# Altium schematic sheet DONGLE01.SchDoc: DONGLE01
size A4; Organization: Organization; Address1: Country; Address2: My Address; Address3: My State; Address4: MyZipCode; DocumentNumber: 1; Revision: 1.4; SheetNumber: 1; SheetTotal: 1
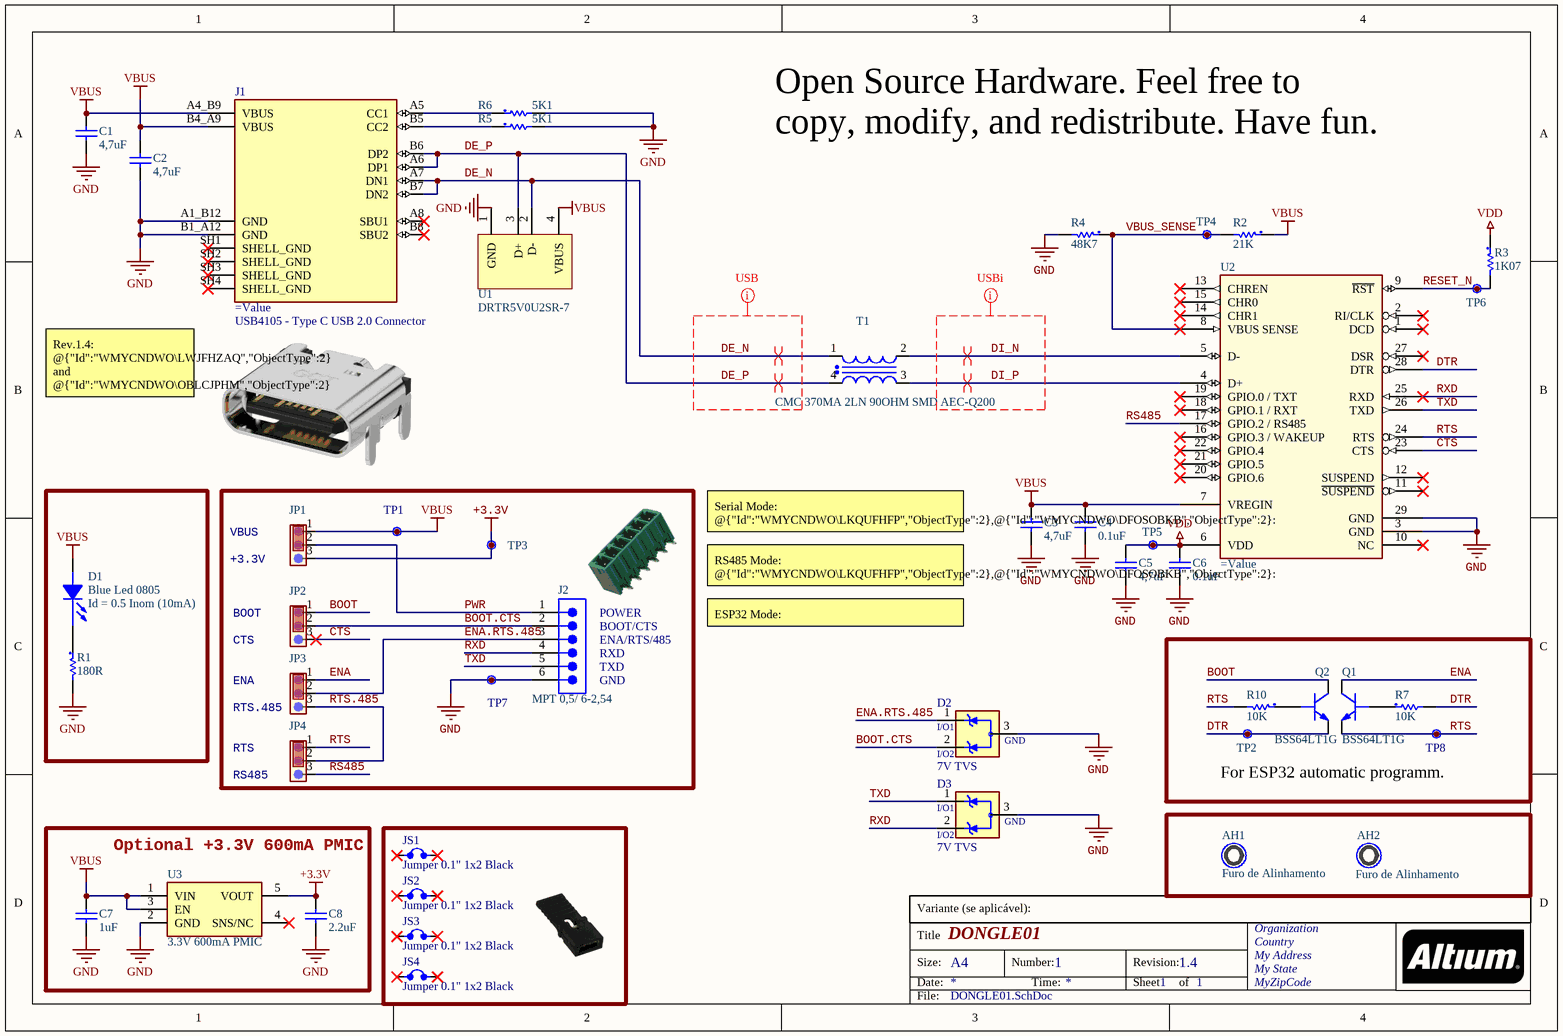
[diagram p0: DONGLE01.SchDoc]

## Parts
AH1  Furo de Alinhamento  [AH_2.0MMD]  (no BOM)
AH2  Furo de Alinhamento  [AH_2.0MMD]  (no BOM)
C1  4,7uF  [C0805]
C2  4,7uF  [C0805]
C3  4,7uF  [C0805]
C4  0.1uF  [C0805]
C5  4,7uF  [C0805]
C6  0.1uF  [C0805]
C7  1uF  [C0805]
C8  2.2uF  [C0805]
D1  Blue Led 0805  Info: Id = 0.5 Inom (10mA)  [LED 0805]
D2  7V TVS  [WE-TVS_SOT23-3L]
D3  7V TVS  [WE-TVS_SOT23-3L]
J1  Info: USB4105 - Type C USB 2.0 Connector  [GCT_USB4105-GF-A-060]
J2  MPT 0,5/ 6-2,54  [1725698]
JP1  Header 3 Pin  [JMP-3-PTH-180]  (value not drawn)  (no BOM)
JP2  Header 3 Pin  [JMP-3-PTH-180]  (value not drawn)  (no BOM)
JP3  Header 3 Pin  [JMP-3-PTH-180]  (value not drawn)  (no BOM)
JP4  Header 3 Pin  [JMP-3-PTH-180]  (value not drawn)  (no BOM)
JS1  Jumper 0.1" 1x2 Black  [BERG-M-2V]  (mechanical)
JS2  Jumper 0.1" 1x2 Black  [BERG-M-2V]  (mechanical)
JS3  Jumper 0.1" 1x2 Black  [BERG-M-2V]  (mechanical)
JS4  Jumper 0.1" 1x2 Black  [BERG-M-2V]  (mechanical)
Q1  BSS64LT1G  [SOT-23]
Q2  BSS64LT1G  [SOT-23]
R1  180R  [R0805]
R2  21K  [R0805]
R3  1K07  [R0805]
R4  48K7  [R0805]
R5  5K1  [R0805]
R6  5K1  [R0805]
R7  10K  [R0805]
R10  10K  [R0805]
T1  CMC 370MA 2LN 90OHM SMD AEC-Q200  [744232090]
TP1  (no value)  [TP]  (no BOM)
TP2  (no value)  [TP]  (no BOM)
TP3  (no value)  [TP]  (no BOM)
TP4  (no value)  [TP]  (no BOM)
TP5  (no value)  [TP]  (no BOM)
TP6  (no value)  [TP]  (no BOM)
TP7  (no value)  [TP]  (no BOM)
TP8  (no value)  [TP]  (no BOM)
U1  Manufacturer P/N: DRTR5V0U2SR-7  [SOT143-4]  (hidden comment: USB ESD protection)
U2  (no value)  [QFN50P500X500X80_HS-29N CP2102N]
U3  3.3V 600mA PMIC  [SOT94P280X100-5N]

## Blocks framed on the sheet
Optional +3.3V 600mA PMIC: C7 C8 U3

## Nets
+3.3V: C8.1 JP1.3 TP3.1(A) U3.5(VOUT)
GND: C1.2 C2.2 C3.2 C4.2 C5.2 C6.2 C7.2 C8.2 D2.3(GND) D3.3(GND) J1.A1_B12(GND) J1.B1_A12(GND) J2.6 R1.2 R4.2 R5.2 R6.2 TP7.1(A) U1.1(GND) U2.3(GND) U2.29(GND) U3.2(GND)
VBUS: C1.1 C2.1 C3.1 C4.1 C7.1 D1.A J1.A4_B9(VBUS) J1.B4_A9(VBUS) JP1.1 R2.1 TP1.1(A) U1.4(VBUS) U2.7(VREGIN) U3.1(VIN) U3.3(EN)
VDD: C5.1 C6.1 R3.1 TP5.1(A) U2.6(VDD)
BOOT: JP2.1 Q2.3(C)
BOOT.CTS: D2.2(I/O2) J2.2 JP2.2
CTS: JP2.3 U2.23(CTS)
DE_N: J1.A7(DN1) J1.B7(DN2) T1.1 U1.2(D-)
DE_P: J1.A6(DP1) J1.B6(DP2) T1.4 U1.3(D+)
DI_N: T1.2 U2.5(D-)
DI_P: T1.3 U2.4(D+)
DTR: Q2.2(E) R7.2 TP2.1(A) U2.28(DTR)
ENA: JP3.1 Q1.3(C)
ENA.RTS.485: D2.1(I/O1) J2.3 JP3.2
PWR: J2.1 JP1.2
RESET_N: R3.2 TP6.1(A) U2.9(~{RST})
RS485: JP4.3 U2.17(GPIO.2_/_RS485)
RTS: JP4.1 Q1.2(E) R10.2 TP8.1(A) U2.24(RTS)
RTS.485: JP3.3 JP4.2
RXD: D3.2(I/O2) J2.4 U2.25(RXD)
TXD: D3.1(I/O1) J2.5 U2.26(TXD)
VBUS_SENSE: R2.2 R4.1 TP4.1(A) U2.8(VBUS_SENSE)
NetD1_K: D1.K R1.1
NetJ1_A5: J1.A5(CC1) R6.1
NetJ1_B5: J1.B5(CC2) R5.1
NetQ1_1: Q1.1(B) R7.1
NetQ2_1: Q2.1(B) R10.1

Not connected (* = marked no-connect by the designer): J1 A8(SBU1)* B8(SBU2)* SH1(SHELL_GND)* SH2(SHELL_GND)* SH3(SHELL_GND)* SH4(SHELL_GND)*; JS1 1* 2*; JS2 1* 2*; JS3 1* 2*; JS4 1* 2*; U2 1(DCD)* 2(RI/CLK)* 10(NC)* 11(~{SUSPEND})* 12(SUSPEND)* 13(CHREN)* 14(CHR1)* 15(CHR0)* 16(GPIO.3_/_WAKEUP)* 18(GPIO.1_/_RXT)* 19(GPIO.0_/_TXT)* 20(GPIO.6)* 21(GPIO.5)* 22(GPIO.4)* 27(DSR)*; U3 4(SNS/NC)*

## Layout directives
differential pair: DE_N, DE_P, DI_N, DI_P
net class USB; rule Differential Pairs Routing [Pref Gap = 4.506mil    Min Gap  = 4.506mil    Max Gap  = 4.506milPref Width = 9mil    Min Width  = 9mil    Max Width  = 9mil]: DE_N, DE_P
net class USBi; rule Differential Pairs Routing [Pref Gap = 4.506mil    Min Gap  = 4.506mil    Max Gap  = 4.506milPref Width = 9mil    Min Width  = 9mil    Max Width  = 9mil]: DI_N, DI_P

## Notes on the sheet
- Open Source Hardware. Feel free to copy, modify, and redistribute. Have fun.
- Rev.1.4: @{"Id":"WMYCNDWO\LWJFHZAQ","ObjectType":2} and @{"Id":"WMYCNDWO\OBLCJPHM","ObjectType":2} corrected to 4,7uF. Added new @{"Id":"WMYCNDWO\WQULBWGF","ObjectType":2}.
- (near JP1) VBUS
- +3.3V
- Serial Mode: @{"Id":"WMYCNDWO\LKQUFHFP","ObjectType":2},@{"Id":"WMYCNDWO\DFOSOBKB","ObjectType":2}: 2-3, @{"Id":"WMYCNDWO\IGVTLTZP","ObjectType":2}: 1-2. Use DONGLE02 module for RS232 levels..
- RS485 Mode: @{"Id":"WMYCNDWO\LKQUFHFP","ObjectType":2},@{"Id":"WMYCNDWO\DFOSOBKB","ObjectType":2}: 2-3, @{"Id":"WMYCNDWO\IGVTLTZP","ObjectType":2}: 2-3. There is no RS485 module (yet).
- BOOT
- CTS
- (near J2) POWER
- (near J2) BOOT/CTS
- (near J2) RXD
- (near J2) ENA/RTS/485
- ESP32 Mode: @{"Id":"WMYCNDWO\LKQUFHFP","ObjectType":2},@{"Id":"WMYCNDWO\DFOSOBKB","ObjectType":2}: 1-2, @{"Id":"WMYCNDWO\IGVTLTZP","ObjectType":2}: don't care
- ENA
- RTS.485
- (near J2) TXD
- (near J2) GND
- RTS
- (near JP4) RS485
- For ESP32 automatic programm.
- Variante (se aplicável):
- Title
- Size:
- Date:
- A4
- Number:
- Time:
- Revision:
- Sheet
- of
- File:

## Library data of the parts
AH1 AH2 = Aligment Hole M2: RefDes: RefDes
C1-C3 C5 = CAP: 4.7 µF ±5% 25V Capacitor de cerâmica X7R 0805 (métrico 2012); Manufacturer: KEMET; Manufacturer P/N: C0805C475J3RACTU; Info: 25V 5% X7R; Supplier: Digikey; Supplier P/N (TR): 399-C0805C475J3RACTUTR-ND; Value: 4,7uF; Supplier P/N (CT): 399-C0805C475J3RACTUCT-ND; Datasheet: https://www.yageogroup.com/content/datasheet/asset/file/KEM_C1002_X7R_SMD; RefDes: RefDes; Supplier Web Page: https://www.digikey.com.br/pt/products/detail/kemet/C0805C475J3RACTU/12700961
C4 C6 = CAP: 0.1 µF ±10% 100V Ceramic Capacitor X7R 0805 (2012 Metric); Manufacturer: Murata Electronics; Manufacturer P/N: GCM21BR72A104KA37L; Info: MLCC; Supplier: Digikey; Supplier P/N (Tape & Reel): 490-4789-2-ND; Value: 0.1uF; Supplier P/N (Cut Tape): 490-4789-1-ND; Datasheet: https://search.murata.co.jp/Ceramy/image/img/A01X/G101/ENG/GCM033R71A103KA03-01A.pdf; RefDes: RefDes; Supplier Web Page: https://www.digikey.com/en/products/detail/murata-electronics/GCM21BR72A104KA37L/1641663?s=N4IgTCBcDaICwE4AMBaOB2AHAlA2FAcgCIgC6AvkA
C7 = CAP: 1 µF ±5% 16V Ceramic Capacitor X7R 0805 (2012 Metric); Manufacturer: KEMET; Manufacturer P/N: C0805C105J4RAC7800; Info: MLCC; Supplier: Digikey; Supplier P/N (Tape & Reel): 399-C0805C105J4RAC7800TR-ND; Value: 1uF; Supplier P/N (Cut Tape): 399-C0805C105J4RAC7800CT-ND; Datasheet: https://connect.kemet.com:7667/gateway/IntelliData-ComponentDocumentation/1.0/download/datasheet/C0805C105J4RACTU; RefDes: RefDes; Supplier Web Page: https://www.digikey.com/en/products/detail/kemet/C0805C105J4RAC7800/2211759?s=N4IgTCBcDaIMIAYAcCCscCMaBSAWASgIJwDsKCIAugL5A
C8 = CAP: 2.2 µF ±5% 16V Ceramic Capacitor X7R 0805 (2012 Metric); Manufacturer: KEMET; Manufacturer P/N: C0805C225J4REC7800; Info: MLCC; Supplier: Digikey; Supplier P/N (Tape & Reel): 399-C0805C225J4REC7800TR-ND; Value: 2.2uF; Supplier P/N (Cut Tape): 399-C0805C225J4REC7800CT-ND; Datasheet: https://content.kemet.com/datasheets/KEM_C1090_X7R_ESD.pdf; RefDes: RefDes; Supplier Web Page: https://www.digikey.com/en/products/detail/kemet/C0805C225J4REC7800/8643702?s=N4IgTCBcDaIMIAYAcCCscxlQKQCwCUBROAdhQRAF0BfIA
D1 = LED GREEN 0805: Blue 470nm LED Indication - Discrete 3.2V 0805 (2012 Metric); Manufacturer: Würth Elektronik; Manufacturer P/N: 150080BS75000; RefDes: RefDes; Value: Blue Led 0805; Supplier Web Page: https://www.digikey.com/en/products/detail/w%C3%BCrth-elektronik/150080BS75000/4489912; Supplier P/N (Tape & Reel): 732-4982-2-ND; Supplier P/N (Cut Tape): 732-4982-1-ND; Supplier: Digikey; Datasheet: https://www.we-online.com/components/products/datasheet/150080BS75000.pdf
D2 D3 = WE-TVS_SOT23-3L_824021: 7V Clamp 15A (8/20µs) Ipp Tvs Diode Surface Mount SOT-23-3; Manufacturer: Würth Elektronik; Manufacturer P/N: 824021; Value: 7V TVS; RefDes: RefDes; Supplier: Digikey; Supplier P/N (Cut Tape): 732-4468-1-ND; Supplier P/N (Tape & Reel): 732-4468-2-ND; Supplier Web Page: https://www.digikey.com/en/products/detail/w%C3%BCrth-elektronik/824021/3900544; Datasheet: https://www.we-online.com/components/products/datasheet/824021.pdf; Info: TVS Diode
J1 = USB4105-GF-A-060: USB-C (USB TYPE-C) USB 2.0 Receptacle Connector 24 (16+8 Dummy) Position Surface Mount, Right Angle; Through Hole; Manufacturer: Global Connector Technology; Value: USB4105-GF-A-060; Supplier P/N (CT): 2073-USB4105-GF-ACT-ND; Supplier P/N (TR): 2073-USB4105-GF-ATR-ND; Supplier P/N (DR): 2073-USB4105-GF-ADKR-ND; Supplier Web: https://www.digikey.com.br/pt/products/detail/gct/USB4105-GF-A/11198441; Datasheet: https://www.mouser.com/catalog/specsheets/Global_Connector_Technology_usb4105.pdf; Alias1: *; Manufacturer P/N: USB4105-GF-A-060; RefDes: *; Supplier: Digikey
J2 = 691322110006: 6 Position Wire to Board Terminal Block Horizontal with Board 0.100" (2.54mm) Through Hole; Manufacturer: Phoenix Contact; Info: Borne 6pos 6A e=2,54; Manufacturer P/N: 1725698; Supplier: Digikey; Supplier P/N (Tape & Reel): 277-1277-ND; Value: MPT 0,5/ 6-2,54; Datasheet: https://www.phoenixcontact.com/en-us/products/printed-circuit-board-terminal-mpt-05-6-254-1725698?type=pdf; Supplier P/N (Cut Tape): 277-1277-ND; RefDes: RefDes; Supplier Web Page: https://www.digikey.com/en/products/detail/phoenix-contact/1725698/267466
JP1-JP4 = Jumper 3: 3 Pin Jumper; Manufacturer P/N: 61300311121; Manufacturer: Würth Elektronik; Info: 0.1" Pin header 1x3; RefDes: RefDes; Value: Header 3 Pin; Supplier Web Page: https://www.digikey.com/en/products/detail/w%C3%BCrth-elektronik/61300311121/4846825; Supplier P/N (Tape & Reel): 732-5316-ND; Supplier P/N (Cut Tape): 732-5316-ND; Supplier: Digikey; Datasheet: https://www.we-online.com/components/products/datasheet/61300311121.pdf
JS1-JS4 = Jumper 2: 2 (1 x 2) Position Shunt Connector Open Top, Grip 0.100" (2.54mm) Gold; Manufacturer P/N: NPC02SXON-RC; Manufacturer: Sullins Connector Solutions; RefDes: RefDes; Info: Jumper 0.1" 1x2 Black; Value: Jumper 0.1" 1x2 Black; Supplier Web Page: https://www.digikey.com/en/products/detail/sullins-connector-solutions/NPC02SXON-RC/2618266; Supplier P/N (Tape & Reel): S9341-ND; Supplier P/N (Cut Tape): S9341-ND; Supplier: Digikey; Datasheet: https://s3.amazonaws.com/catalogspreads-pdf/PAGE128-129%20.100%20JUMPER.pdf
Q1 Q2 = TR-NPN-BC817-SOT23: Bipolar (BJT) Transistor NPN 80 V 100 mA 60MHz 225 mW Surface Mount SOT-23-3 (TO-236); Manufacturer: onsemi; Info: VCEsat max 200mV; Supplier: Digikey; Manufacturer P/N: BSS64LT1G; Value: BSS64LT1G; Supplier P/N (Tape & Reel): BSS64LT1GOSTR-ND; Supplier P/N (Cut Tape): BSS64LT1GOSCT-ND; Datasheet: https://www.onsemi.com/pdf/datasheet/bss64lt1-d.pdf; RefDes: RefDes; Supplier Web Page: https://www.digikey.com/en/products/detail/onsemi/BSS64LT1G/1476267?s=N4IgTCBcDaIEIGUEDYAsAZAKgRgOIgF0BfIA
R1 = RESISTOR: 180 Ohms ±1% 0.25W, 1/4W Chip Resistor 0805 (2012 Metric) Anti-Sulfur Thin Film; Manufacturer: Stackpole Electronics Inc; Manufacturer P/N: RNCP0805FTD180R; Info: 1% 100 PPM; RefDes: RefDes; Supplier: Digikey; Supplier P/N (Tape & Reel): RNCP0805FTD180RTR-ND; Value: 180R; Datasheet: https://www.seielect.com/catalog/sei-rncp.pdf; Supplier P/N (Cut Tape): RNCP0805FTD180RCT-ND; Supplier Web Page: https://www.digikey.com/en/products/detail/stackpole-electronics-inc/RNCP0805FTD180R/2240212
R2 = RESISTOR: 21 kOhms ±1% 0.125W, 1/8W Chip Resistor 0805 (2012 Metric) Moisture Resistant Thick Film; Manufacturer: YAGEO; Manufacturer P/N: RC0805FR-0721KL; Info: 1% 100 PPM; Value: 21K; Supplier P/N (Cut Tape): 311-21.0KCRCT-ND; Supplier: Digikey; Datasheet: https://www.yageo.com/upload/media/product/products/datasheet/rchip/PYu-RC_Group_51_RoHS_L_12.pdf; RefDes: RefDes; Supplier P/N (Tape & Reel): 311-21.0KCRTR-ND; Supplier Web Page: https://www.digikey.com/en/products/detail/yageo/RC0805FR-0721KL/727728
R3 = RESISTOR: 1.07 kOhms ±1% 0.125W, 1/8W Chip Resistor 0805 (2012 Metric) Automotive AEC-Q200 Thick Film; Manufacturer P/N: CRCW08051K07FKEA; Manufacturer: Vishay Dale; Info: 1% 100 PPM; Value: 1K07; Supplier: Digikey; Supplier P/N (Tape & Reel): 541-1.07KCTR-ND; Supplier P/N (Cut Tape): 541-1.07KCCT-ND; Datasheet: https://www.vishay.com/docs/20035/dcrcwe3.pdf; RefDes: RefDes; Supplier Web Page: https://www.digikey.com/en/products/detail/vishay-dale/CRCW08051K07FKEA/1175640
R4 = RESISTOR: 48.7 kOhms ±1% 0.125W, 1/8W Chip Resistor 0805 (2012 Metric) Moisture Resistant Thick Film; Manufacturer P/N: RC0805FR-0748K7L; Manufacturer: YAGEO; Info: 1% 100 PPM; Value: 48K7; Supplier: Digikey; Supplier P/N (Tape & Reel): 311-48.7KCRTR-ND; Supplier P/N (Cut Tape): 311-48.7KCRCT-ND; Datasheet: https://www.yageo.com/upload/media/product/products/datasheet/rchip/PYu-RC_Group_51_RoHS_L_12.pdf; RefDes: RefDes; Supplier Web Page: https://www.digikey.com/en/products/detail/yageo/RC0805FR-0748K7L/727981
R5 R6 = RESISTOR: 5.1 kOhms ±1% 0.125W, 1/8W Chip Resistor 0805 (2012 Metric) Moisture Resistant Thick Film; Manufacturer: YAGEO; Manufacturer P/N: RC0805FR-075K1L; Info: 1% 100 PPM; RefDes: RefDes; Supplier: Digikey; Supplier P/N (Tape & Reel): 311-5.10KCRTR-ND; Value: 5K1; Datasheet: https://www.yageo.com/upload/media/product/products/datasheet/rchip/PYu-RC_Group_51_RoHS_L_12.pdf; Supplier P/N (Cut Tape): 311-5.10KCRCT-ND; Supplier Web Page: https://www.digikey.com/en/products/detail/yageo/RC0805FR-075K1L/727988
R7 R10 = RESISTOR: 10 kOhms ±1% 0.125W, 1/8W Chip Resistor 0805 (2012 Metric) Automotive AEC-Q200 Thick Film; Manufacturer P/N: RMCF0805FT10K0; Manufacturer: Stackpole Electronics Inc; Info: 1% 100PPM; Value: 10K; Supplier: Digikey; Supplier P/N (Tape & Reel): RMCF0805FT10K0TR-ND; Supplier P/N (Cut Tape): RMCF0805FT10K0CT-ND; Datasheet: https://www.seielect.com/catalog/sei-rmcf_rmcp.pdf; RefDes: RefDes; Supplier Web Page: https://www.digikey.com/en/products/detail/stackpole-electronics-inc/RMCF0805FT10K0/1760676
T1 = USB EMI FILTER: 2 Line Common Mode Choke Surface Mount 90 Ohms @ 100 MHz 370mA DCR 300mOhm; Manufacturer: Würth Elektronik; Info: EMI Trafo; Value: CMC 370MA 2LN 90OHM SMD AEC-Q200; Manufacturer P/N: 744232090; Supplier: Digikey; Supplier P/N (Tape & Reel): 732-1469-2-ND; Supplier P/N (Cut Tape): 732-1469-1-ND; Datasheet: https://www.we-online.com/components/products/datasheet/744232090.pdf; RefDes: RefDes; Supplier Web Page: https://www.digikey.com/en/products/detail/w%C3%BCrth-elektronik/744232090/1638873?s=N4IgTCBcDaIOwGYwFoCMAWAbATmZ5AcgCIgC6AvkA
TP1-TP8 = TESTPOINT
  TP1 TP7 TP8: RefDes: rRefDes; Supplier: Digikey
  TP2-TP6: RefDes: RefDes
U1 = USB2.0_TVS_DIODES: Clamp Ipp Tvs Diode Surface Mount SOT-143; Manufacturer: Diodes Incorporated; Info: ESD Protection Device; Value: USB ESD protection; Supplier P/N (Cut Tape): DRTR5V0U2SR-7DICT-ND; Supplier Web Page: https://www.digikey.com/en/products/detail/diodes-incorporated/DRTR5V0U2SR-7/4402528; Supplier P/N (Tape & Reel): DRTR5V0U2SR-7DITR-ND; Supplier: Digikey; Datasheet: https://www.diodes.com/assets/Datasheets/DRTR5V0U2SR.pdf; RefDes: RefDes
U2 = CP2102N QFN28: USB Bridge, USB to UART USB 2.0 UART Interface 28-QFN (5x5); Manufacturer: Silicon Labs; Manufacturer P/N: CP2102N-A02-GQFN28R; Value: CP2102N-A02-GQFN28R; Supplier: Digikey; Supplier P/N (Tape & Reel): 336-5890-2-ND; Supplier P/N (Cut Tape): 336-5890-1-ND; Datasheet: https://www.silabs.com/documents/public/data-sheets/cp2102n-datasheet.pdf; Info: =Value; RefDes: RefDes; Supplier Web Page: https://www.digikey.com/en/products/detail/silicon-labs/CP2102N-A02-GQFN28R/9863480
U3 = RT9080-33GJ5: Linear Voltage Regulator IC Positive Fixed 1 Output 600mA TSOT-23-5; Manufacturer: Richtek USA Inc.; Value: 3.3V 600mA PMIC; Manufacturer P/N: RT9080-33GJ5; Supplier: Digikey; Supplier P/N (Cut Tape): 1028-1509-1-ND; Supplier P/N (Tape & Reel): 1028-1509-2-ND; Datasheet: https://www.richtek.com/assets/product_file/RT9080/DS9080-05.pdf; Info: 3.3V 600mA PMIC; RefDes: RefDes; Supplier Web Page: https://www.digikey.com/en/products/detail/richtek-usa-inc/RT9080-33GJ5/6161634?s=N4IgTCBcDaIEoBUCcAGAHCgtAZmwcQCkBWEAXQF8g